# EAGLE design uwb (EAGLE 9.6.2)
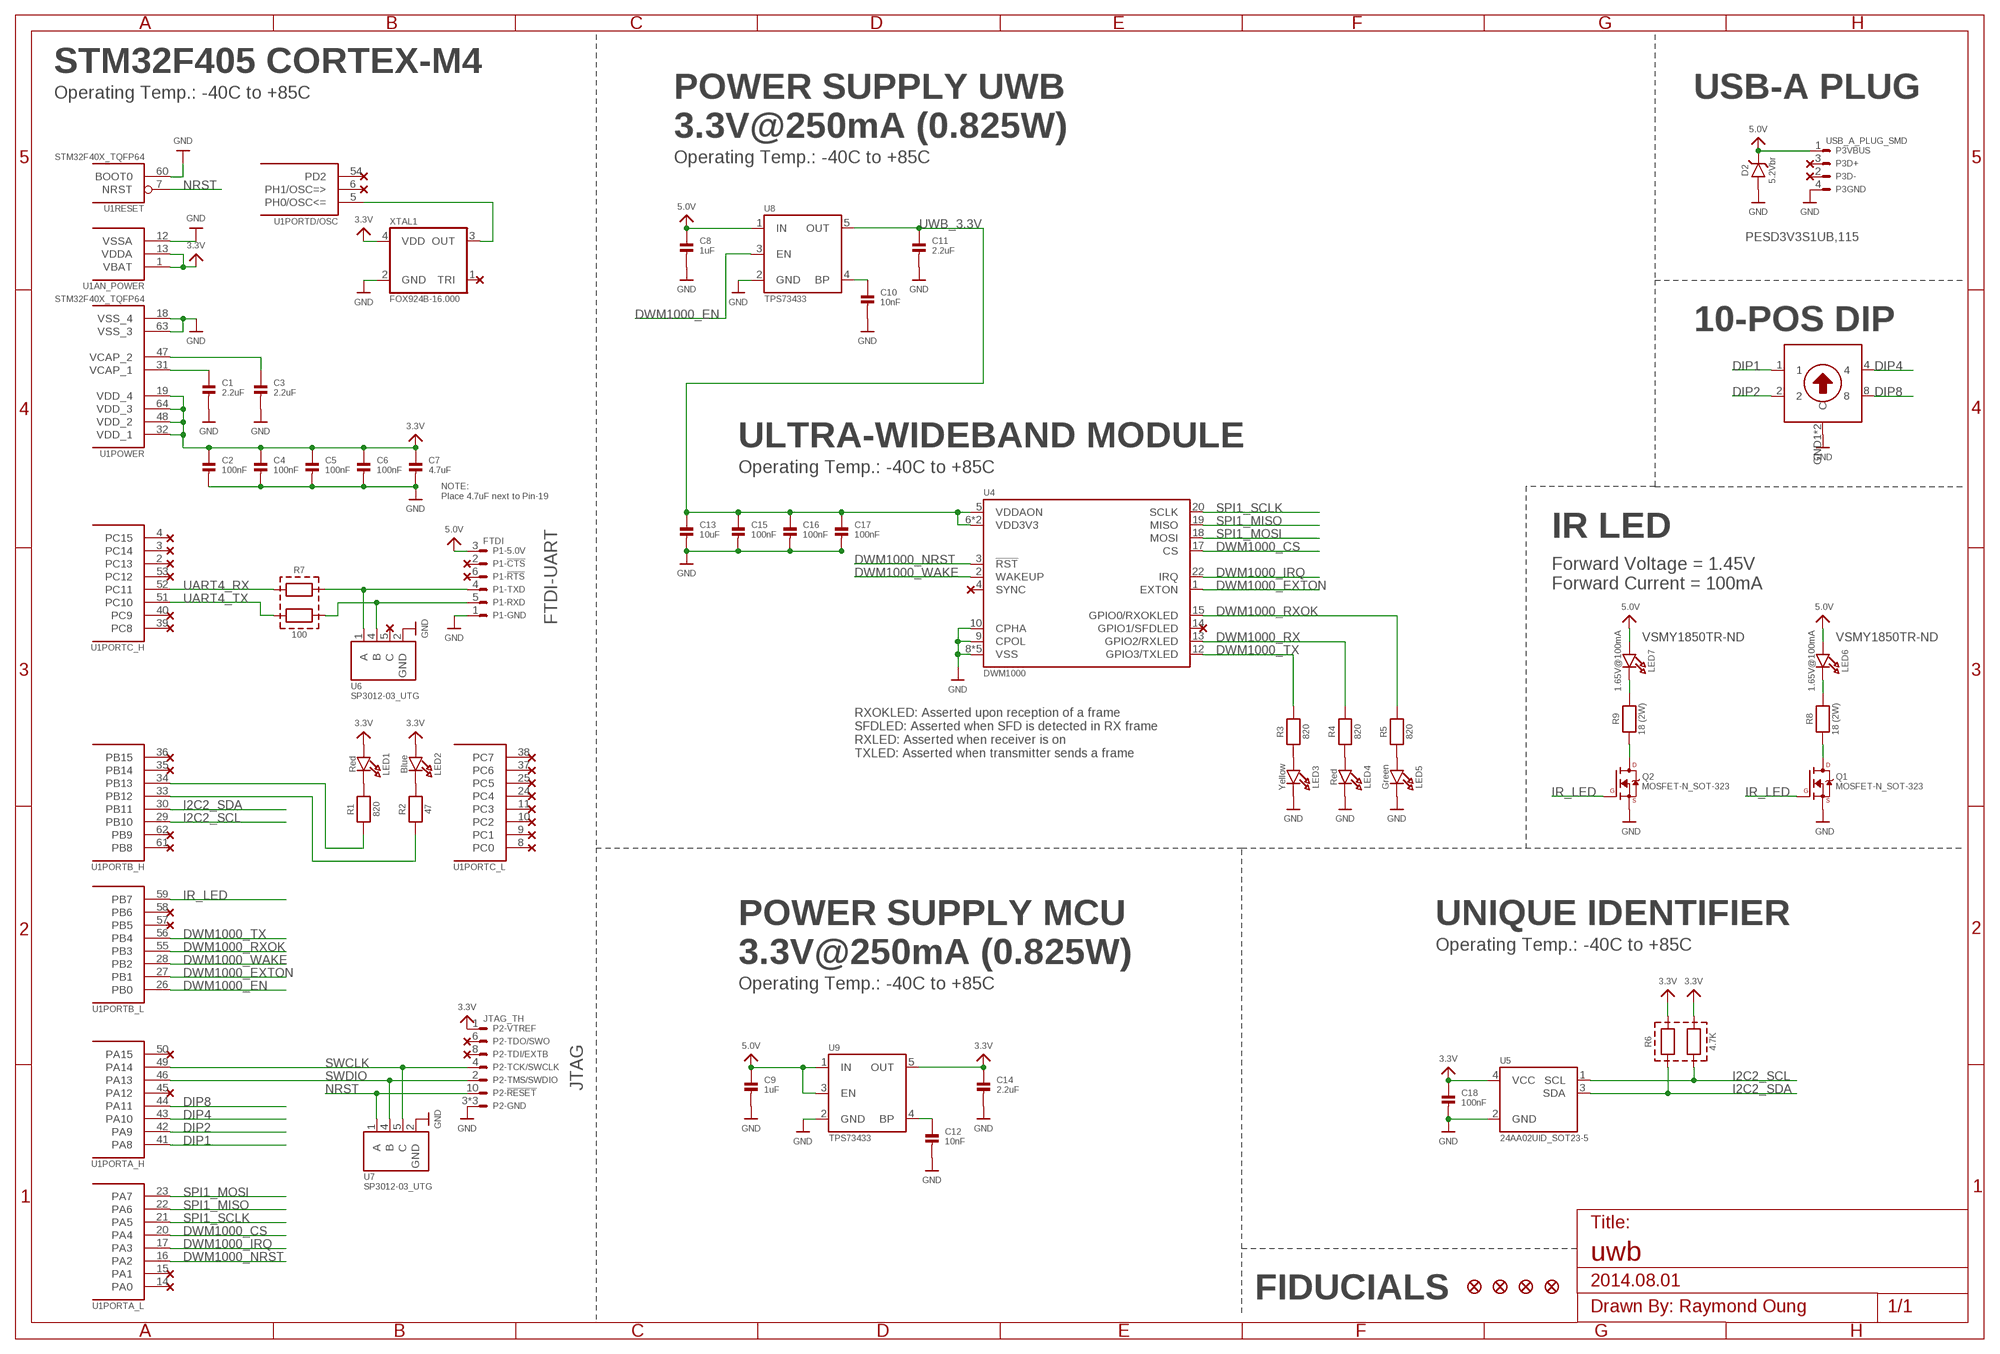
[diagram p0: schematic, sheet 1]

## Parts
C1  2.2uF  CAP_CERAMIC0402  [0402]
C2  100nF  CAP_CERAMIC0402  [0402]
C3  2.2uF  CAP_CERAMIC0402  [0402]
C4  100nF  CAP_CERAMIC0402  [0402]
C5  100nF  CAP_CERAMIC0402  [0402]
C6  100nF  CAP_CERAMIC0402  [0402]
C7  4.7uF  CAP_CERAMIC0402  [0402]
C8  1uF  CAP_CERAMIC0402  [0402]
C9  1uF  CAP_CERAMIC0402  [0402]
C10  10nF  CAP_CERAMIC0402  [0402]
C11  2.2uF  CAP_CERAMIC0402  [0402]
C12  10nF  CAP_CERAMIC0402  [0402]
C13  10uF  CAP_CERAMIC0603  [0603]
C14  2.2uF  CAP_CERAMIC0402  [0402]
C15  100nF  CAP_CERAMIC0402  [0402]
C16  100nF  CAP_CERAMIC0402  [0402]
C17  100nF  CAP_CERAMIC0402  [0402]
C18  100nF  CAP_CERAMIC0402  [0402]
D2  5.2Vbr  DIODE_ZENER_SOD523  [SOD-523]
LED1  Red  LED_0603  [CHIPLED_0603]
LED2  Blue  LED_0603  [CHIPLED_0603]
LED3  Yellow  LED_0603  [CHIPLED_0603]
LED4  Red  LED_0603  [CHIPLED_0603]
LED5  Green  LED_0603  [CHIPLED_0603]
LED6  1.65V@100mA  LED_0805  [CHIPLED_0805]
LED7  1.65V@100mA  LED_0805  [CHIPLED_0805]
P1  FTDI  [1X06_LOCK]
P2  JTAG_TH  [FTSH-105-01-XXX-DV]
P3  USB_A_PLUG_SMD  [USB-A_SMD]
P4  DIP10_SH-7000B  [SH-7000B]
Q1  MOSFET-N_SOT-323  [SOT323]
Q2  MOSFET-N_SOT-323  [SOT323]
R1  820  RESISTOR0402  [0402]
R2  47  RESISTOR0402  [0402]
R3  820  RESISTOR0402  [0402]
R4  820  RESISTOR0402  [0402]
R5  820  RESISTOR0402  [0402]
R6  4.7K  RESISTOR2_0603X2  [EXBV4V]
R7  100  RESISTOR2_0603X2  [EXBV4V]
R8  18 (2W)  RESISTOR2512  [2512]
R9  18 (2W)  RESISTOR2512  [2512]
REF1  FIDUCIAL1X2.5  [POINT-1MM]
REF2  FIDUCIAL1X2.5  [POINT-1MM]
REF3  FIDUCIAL1X2.5  [POINT-1MM]
REF4  FIDUCIAL1X2.5  [POINT-1MM]
U1  STM32F40X_TQFP64  [TQFP64]
U4  DWM1000  [DWM1000]
U5  24AA02UID_SOT23-5  [SOT23-5]
U6  SP3012-03_UTG  [UDFN06]
U7  SP3012-03_UTG  [UDFN06]
U8  TPS73433  [SOT23-5]
U9  TPS73433  [SOT23-5]
XTAL1  FOX924B-16.000  TCXO_5.0X3.2A  [OSCILLATOR-5.0X3.2A]

## Nets
3.3V [PWR]: C2.1 C4.1 C5.1 C6.1 C7.1 C14.1 C18.1 LED1.A LED2.A P2.1 R6.3 R6.4 U1.1(AN_POWER:VBAT) U1.13(AN_POWER:VDDA) U1.19(POWER:VDD_4) U1.32(POWER:VDD_1) U1.48(POWER:VDD_2) U1.64(POWER:VDD_3) U5.4(VCC) U9.5(OUT) XTAL1.4(VDD)
5.0V [PWR]: C8.1 C9.1 D2.K(C) LED6.A LED7.A P1.3 P3.1 U8.1(IN) U9.1(IN) U9.3(EN)
DIP1: P4.1 U1.41(PORTA_H:PA8)
DIP2: P4.2 U1.42(PORTA_H:PA9)
DIP4: P4.4 U1.43(PORTA_H:PA10)
DIP8: P4.8 U1.44(PORTA_H:PA11)
DWM1000_CS: U1.20(PORTA_L:PA4) U4.17(CS)
DWM1000_EN: U1.26(PORTB_L:PB0) U8.3(EN)
DWM1000_EXTON: U1.27(PORTB_L:PB1) U4.1(EXTON)
DWM1000_IRQ: U1.17(PORTA_L:PA3) U4.22(IRQ)
DWM1000_NRST: U1.16(PORTA_L:PA2) U4.3(!RST)
DWM1000_RX: R4.2 U4.13(GPIO2/RXLED)
DWM1000_RXOK: R5.2 U1.55(PORTB_L:PB3) U4.15(GPIO0/RXOKLED)
DWM1000_TX: R3.2 U1.56(PORTB_L:PB4) U4.12(GPIO3/TXLED)
DWM1000_WAKE: U1.28(PORTB_L:PB2) U4.2(WAKEUP)
GND: C1.2 C2.2 C3.2 C4.2 C5.2 C6.2 C7.2 C8.2 C9.2 C10.2 C11.2 C12.2 C13.2 C14.2 C15.2 C16.2 C17.2 C18.2 D2.A LED3.C LED4.C LED5.C P1.1 P2.3 P2.5 P2.9 P3.4 P4.GND1(C) P4.GND2(C) Q1.2(S) Q2.2(S) U1.12(AN_POWER:VSSA) U1.18(POWER:VSS_4) U1.60(RESET:BOOT0) U1.63(POWER:VSS_3) U4.8(VSS) U4.9(CPOL) U4.10(CPHA) U4.16(VSS) U4.21(VSS) U4.23(VSS) U4.24(VSS) U5.2(GND) U6.2(GND) U7.2(GND) U8.2(GND) U9.2(GND) XTAL1.2(GND)
I2C2_SCL: R6.2 U1.29(PORTB_H:PB10) U5.1(SCL)
I2C2_SDA: R6.1 U1.30(PORTB_H:PB11) U5.3(SDA)
IR_LED: Q1.1(G) Q2.1(G) U1.59(PORTB_L:PB7)
N$1: LED3.A R3.1
N$2: LED4.A R4.1
N$3: R2.1 U1.33(PORTB_H:PB12)
N$4: C10.1 U8.4(BP)
N$5: LED1.C R1.2
N$6: R1.1 U1.34(PORTB_H:PB13)
N$7: P1.5 R7.3 U6.4(B)
N$8: P1.4 R7.4 U6.1(A)
N$9 [PWR]: Q1.3(D) R8.1
N$10 [PWR]: LED6.C R8.2
N$11 [PWR]: Q2.3(D) R9.1
N$12 [PWR]: LED7.C R9.2
N$13: LED5.A R5.1
N$17: U1.5(PORTD/OSC:PH0/OSC<=) XTAL1.3(OUT)
N$19: LED2.C R2.2
N$42: C12.1 U9.4(BP)
NRST: P2.10 U1.7(RESET:NRST) U7.1(A)
SPI1_MISO: U1.22(PORTA_L:PA6) U4.19(MISO)
SPI1_MOSI: U1.23(PORTA_L:PA7) U4.18(MOSI)
SPI1_SCLK: U1.21(PORTA_L:PA5) U4.20(SCLK)
SWCLK: P2.4 U1.49(PORTA_H:PA14) U7.5(C)
SWDIO: P2.2 U1.46(PORTA_H:PA13) U7.4(B)
UART4_RX: R7.1 U1.52(PORTC_H:PC11)
UART4_TX: R7.2 U1.51(PORTC_H:PC10)
UWB_3.3V [PWR]: C11.1 C13.1 C15.1 C16.1 C17.1 U4.5(VDDAON) U4.6(VDD3V3) U4.7(VDD3V3) U8.5(OUT)
VCAP_1: C1.1 U1.31(POWER:VCAP_1)
VCAP_2: C3.1 U1.47(POWER:VCAP_2)
Unconnected: P1.2 P1.6 P2.6 P2.8 P3.2 P3.3 U1.2(PORTC_H:PC13) U1.3(PORTC_H:PC14) U1.4(PORTC_H:PC15) U1.6(PORTD/OSC:PH1/OSC=>) U1.8(PORTC_L:PC0) U1.9(PORTC_L:PC1) U1.10(PORTC_L:PC2) U1.11(PORTC_L:PC3) U1.14(PORTA_L:PA0) U1.15(PORTA_L:PA1) U1.24(PORTC_L:PC4) U1.25(PORTC_L:PC5) U1.35(PORTB_H:PB14) U1.36(PORTB_H:PB15) U1.37(PORTC_L:PC6) U1.38(PORTC_L:PC7) U1.39(PORTC_H:PC8) U1.40(PORTC_H:PC9) U1.45(PORTA_H:PA12) U1.50(PORTA_H:PA15) U1.53(PORTC_H:PC12) U1.54(PORTD/OSC:PD2) U1.57(PORTB_L:PB5) U1.58(PORTB_L:PB6) U1.61(PORTB_H:PB8) U1.62(PORTB_H:PB9) U4.4(SYNC) U4.14(GPIO1/SFDLED) U6.5(C) XTAL1.1(TRI)

## Notes on the sheet
- STM32F405 CORTEX-M4
- Operating Temp.: -40C to +85C | USB-A PLUG
- POWER SUPPLY UWB
  3.3V@250mA (0.825W)
- Operating Temp.: -40C to +85C
- PESD3V3S1UB,115
- 10-POS DIP
- ULTRA-WIDEBAND MODULE
- Operating Temp.: -40C to +85C
- NOTE:
  Place 4.7uF next to Pin-19
- IR LED
- FTDI-UART
- Forward Voltage = 1.45V
  Forward Current = 100mA
- VSMY1850TR-ND | VSMY1850TR-ND
- RXOKLED: Asserted upon reception of a frame
  SFDLED: Asserted when SFD is detected in RX frame
  RXLED: Asserted when receiver is on
  TXLED: Asserted when transmitter sends a frame
- UNIQUE IDENTIFIER
- Operating Temp.: -40C to +85C
- POWER SUPPLY MCU
  3.3V@250mA (0.825W)
- Operating Temp.: -40C to +85C
- JTAG
- 2014.08.01
- FIDUCIALS

## Library data of the parts
C1-C18 = custom-generic:CAP_CERAMIC: Ceramic Capacitor 0402 - 0402 Surface Mount Capacitors 16pF 50V 5% [Digikey: 445-4899-2-ND] 18pF 50V 5% [Digikey: 490-1281-2-ND] 22pF 50V 5% [Digikey: 490-1283-2-ND] 68pF 50V 5% [Digikey: 490-1289-2-ND] 0.1uF 10V 10% [Digikey: 490-1318-2-ND] 1.0uF 6.3V 10% [Digikey: 490-1320-2-ND] 0603 - 0603 Surface Mount Capacitors 16 pF 50V 5% [Digikey: 445-5051-2-ND] 22 pF 50V [Digikey: PCC220ACVTR-ND] 33 pF 50V 5% [Digikey: 490-1415-1-ND] 56pF 50V 5% [Digikey: 490-1421-1-ND] 220pF 50V 5% [Digikey: 445-1285-1-ND] 680 pF 50V 2200 pF 50V 5% C0G [Digikey: 445-1297-1-ND] 5600 pF 100V 5% X7R [Digikey: 478-3711-1-ND] 0.1 µF 25V 10% [Digikey: PCC2277TR-ND] 0.22 µF 16V 10% X7R [Digikey: 445-1318-1-ND] 1.0 µF 25V 10% [Digikey: 445-5146-2-ND] 0603 - RF Specific 3pF 250V +/-0.1pF RF [Digikey: 712-1347-1-ND] 18 pF 250V 5% [Digikey: 478-3505-1-ND or 712-1322-1-ND] 56 pF 250V 5% C0G RF [Digikey: 490-4867-1-ND] 68 pF 250V RF [Digikey: 490-4868-1-ND] 0805 - 0805 Surface Mount Capacitors 220 pF 250V 2% RF Ceramic Capacitor [Digikey: 712-1398-1-ND] 1000 pF 50V 2% NP0 Ceramic Capacitor [Digikey: 478-3760-1-ND] 0.1 µF 25V 10% Ceramic Capacitor [Digikey: PCC1828TR-ND] 1.0 µF 16V 10% Ceramic Capacitor[Digikey: 490-1691-2-ND] 10.0 µF 10V 10% Ceramic Capacitor[Digikey: 709-1228-1-ND] 10.0 uF 16V 10% Ceramic Capacitor [Digikey: 478-5165-2-ND] 47 uF 6.3V 20% Ceramic Capacitor [Digikey: 587-1779-1-ND or 399-5506-1-ND] 1206 - 1206 Surface Mount Capacitors 47uF 10V 20% Ceramic Capacitor [Digikey: 490-5528-1-ND or 399-5508-1-ND or 445-6010-1-ND]
D2 = custom-generic:DIODE_ZENER: Zener Diode / Transient Voltage Suppression Diode
LED1-LED7 = custom-generic:LED: LED 0603 - 0603 Surface Mount Package 2mA: Blue LED - Low Power (39.2mcd, 10 mA, 3.1Vf) - DigiKey: 475-1383-1-ND Green LED - Low Power (3.9mcd, 2mA, 1.7Vf) - Digikey: 475-2709-1-ND Orange LED - Low Power (9.8mcd, 2mA, 1.8Vf) - Digikey: 475-1194-2-ND Red LED - Low Power (5mcd, 2mA, 1.8Vf) - Digikey: 475-2506-1-ND Yellow LED - Low Power (7mcd, 2mA, 1.8Vf) - Digikey: 475-1196-1-ND 5mA: Blue LED - Low Power (17mcd, 5ma, 2.9Vf) - Digikey: LNJ937W8CRACT-ND 0805 - 0805 Surface Mount Package 2mA: Red LED (8.8mcd, 2mA, 1.8Vf, Clear) - Low Power [Digikey: 475-2510-1-ND] Green LED (5mcd, 2mA, 1.8Vf, Clear) - Low Power [Digikey: 475-2730-1-ND] Yellow LED (11.3mcd, 2mA, 1.8Vf, Clear) - Low Power [Digikey: 475-2555-1-ND] 20mA: Red LED (104mcd, 20mA, Diffused) - LS R976 [Digikey: 475-1278-6-ND] Red LED (12mcd, 20mA, 2.0Vf, Clear) - APT2012EC [Digikey: 754-1128-1-ND] Green LED (15mcd, 20mA, 2.2Vf, Clear) - APT2012GC [Digikey: 754-1131-1-ND] Orange LED (160mcd, 20mA, 2.1Vf, Clear) - APT2012SECK [Digikey: 754-1130-1-ND] 1206 - 1206 Surface Mount Package Green LED (26mcd, 20mA, Diffused) - LG N971 [Digikey: 475-1407-6-ND] Red LED (15mcd, 20mA, Diffused) - LH N974 [Digikey: 475-1416-6-ND]
P1 = custom-connectors:FTDI: USB TTL Serial Cable
P2 = custom-connectors:JTAG: JTAG Connector; DIGI-KEY: 952-1383-ND; MOUSER: 855-M50-3500542
P3 = custom-connectors:USB: USB-A Plug; DIGI-KEY: 1175-1021-ND
P4 = custom-mechanical:DIP10: 10-Position Rotary Switch with Shaft; DIGI-KEY: CT3096CT-ND
Q1 Q2 = custom-devices:MOSFET-N: N-Channel MOSFET; DIGI-KEY: 568-10309-1-ND; MOUSER: 771-BSS138PW115
R1-R5 R8 R9 = custom-generic:RESISTOR: Resistors 0402 - 0402 Surface Mount Package 22 Ohm 1% 1/16W [Digikey: 311-22.0LRTR-ND] 33 Ohm 5% 1/16W 1.0K 5% 1/16W 1.5K 5% 1/16W 2.0K 1% 1/16W 10.0K 1% 1/16W [Digikey: 311-10.0KLRTR-ND] 10.0K 5% 1/16W [Digikey: RMCF0402JT10K0TR-ND] 12.1K 1% 1/16W [Digikey: 311-22.0LRTR-ND] 100.0K 5% 1/16W 0603 - 0603 Surface Mount Package 0 Ohm 1/10 Watt 1% Resistor 15 Ohm 1/10 Watt 1% Resistor 33 Ohm 1/10 Watt 1% Resistor 49.9 Ohm 1/10 Watt 1% Resistor 100 Ohm 1/10 Watt 1% Resistor 150 Ohm 1/10 Watt 1% Resistor 240 Ohm 1/10 Watt 1% Resistor 390 Ohm 1/10 Watt 1% Resistor 560 Ohm 1/10 Watt 1% Resistor 680 Ohm 1/10 Watt 1% Resistor 750 Ohm 1/10 Watt 1% Resistor 1.0K Ohm 1/10 Watt 1% Resistor 1.5K Ohm 1/10 Watt 1% Resistor 2.0K Ohm 1/10 Watt 1% Resistor 2.2K Ohm 1/10 Watt 1% Resistor 3.3K Ohm 1/10 Watt 1% Resistor 4.7K Ohm 1/10 Watt 1% Resistor 10.0K Ohm 1/10 Watt 1% Resistor 12.0K Ohm 1/10 Watt 1% Resistor 12.1K Ohm 1/10 Watt 1% Resistor 20.0K Ohm 1/10 Watt 1% Resistor 33.0K Ohm 1/10 Watt 1% Resistor 100.0K Ohm 1/10 Watt 1% Resistor 0805 - 0805 Surface Mount Package 0 Ohm 1/8 Watt 1% Resistor 33 Ohm 1/8 Watt 1% Resistor 100 Ohm 1/8 Watt 1% Resistor 150 Ohm 1/8 Watt 1% Resistor 200 Ohm 1/8 Watt 1% Resistor 240 Ohm 1/8 Watt 1% Resistor 330 Ohm 1/8 Watt 1% Resistor 390 Ohm 1/8 Watt 1% Resistor 470 Ohm 1/8 Watt 1% Resistor 1.0K Ohm 1/8 Watt 1% Resistor 1.5K Ohm 1/8 Watt 1% Resistor 2.0K Ohm 1/8 Watt 1% Resistor 4.7K Ohm 1/8 Watt 1% Resistor 5.1K Ohm 1/8 Watt 1% Resistor 5.6K Ohm 1/8 Watt 1% Resistor 10.0K Ohm 1/8 Watt 1% Resistor 22.0K Ohm 1/8 Watt 1% Resistor 33.0K Ohm 1/8 Watt 1% Resistor 100K Ohm 1/8 Watt 1% Resistor 1206 - 1206 Surface Mount Package 2012 - 2010 Surface Mount Package 0.11 Ohm 1/2 Watt 1% Resistor - Digikey: RHM.11UCT-ND
R6 R7 = custom-generic:RESISTOR2: 2x Isolated Resistor Network
REF1-REF4 = custom-mechanical:FIDUCIAL: Fiducial Alignment Points Various fiducial points for machine vision alignment.
U1 = custom-devices:STM32F40X_TQFP64: STM32F40x 64-pin LQFP; DIGI-KEY: 497-11767-ND; MOUSER: 511-STM32F405RGT6
U4 = custom-devices:DWM1000: DecaWave Ultra-Wideband Module; DIGI-KEY: 1479-1002-1-ND
U5 = custom-devices:24AA02UID: 2K I2C Serial EEPROMs with Unique 32-bit Serial Number; DIGI-KEY: 24AA02UIDT-I/OTCT-ND
U6 U7 = custom-devices:SP3012-03: TVS Diode Arrays 3-Ch 12KV 0.5pF; DIGI-KEY: F6292CT-ND; MOUSER: 576-SP3012-03UTG
U8 U9 = custom-devices:TPS73433: 3.3V, 250mA, Low Quiescent Current, Ultra-Low Noise, High PSRR Low-Dropout Linear Regulator.; DIGI-KEY: 296-36844-1-ND; MOUSER: 595-TPS73433TDDCRQ1
XTAL1 = custom-generic:TCXO: Temperature Compensated Crystal Oscillator

## Net classes
0 default: width 0.152 mm, drill 0.305 mm, clearance 0.152 mm
1 PWR: width 0.203 mm, drill 0.305 mm, clearance 0.203 mm
2 GND: width 0.152 mm, drill 0.305 mm, clearance 0.203 mm

## Board
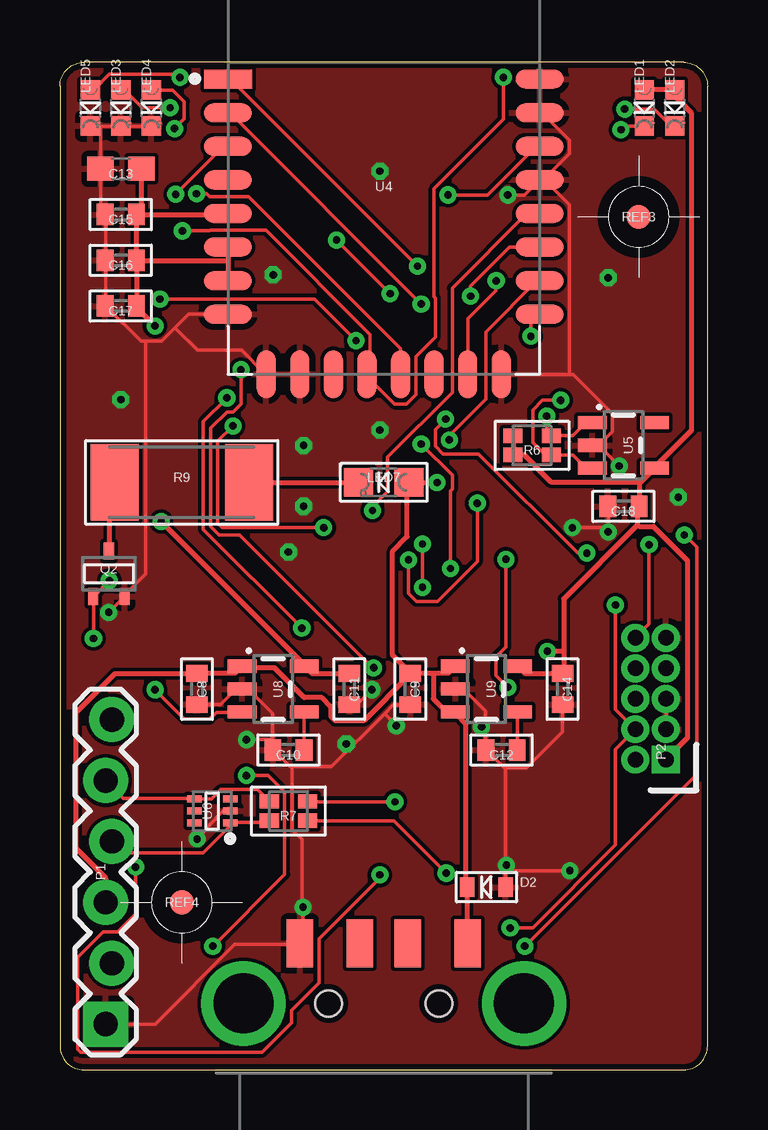
[diagram p1: board, top side]
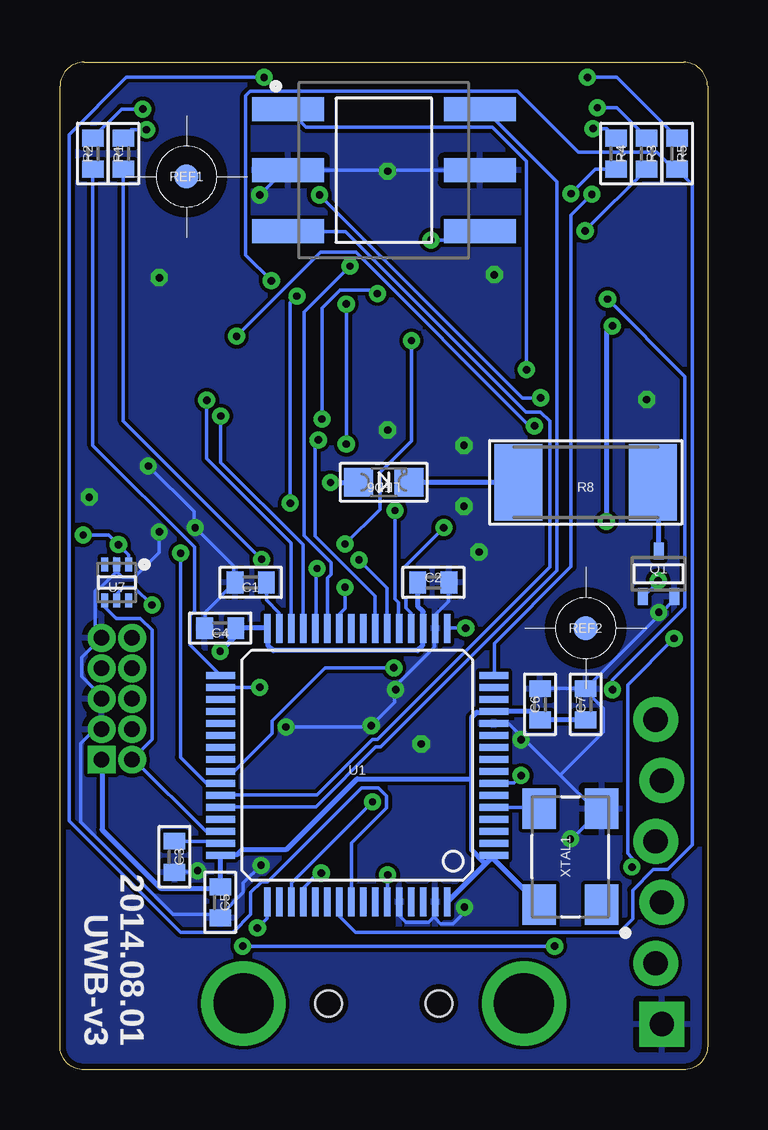
[diagram p2: board, bottom side, seen from below]

Size 27 x 42 mm. Coordinates in mm from the lower left corner, seen from the top.
Outline: 1,0 26,0 arc90 27,1 27,41 arc90 26,42 1,42 arc90 0,41 0,1 arc90 1,0
Copper layers (1*16): Top 0.035mm / dielectric 1.5mm / Bottom 0.035mm
Design rules "BetaLayout-2layer": minimum track width 6mil, minimum drill 8mil, track to track 6mil, track to pad 6mil, pad to pad 6mil, via to via 6mil, smd to smd 0mil, copper to edge 10mil, drill to drill 10mil, minimum pad ring 10mil, minimum via ring 8mil, stop-mask expansion 2mil, vias tented up to drill 100mil, thermal gap 10mil

### Footprints (pad centres in the part's own frame; a part is rotated, then mirrored left to right if it is on the bottom)
0402 = smd 0.7 x 0.9: 1 -0.65,0; 2 0.65,0
0603 = smd 1.1 x 1: 1 -0.85,0; 2 0.85,0
SOD-523 = smd 0.8 x 0.6: A 0,-0.8; K 0,0.8
CHIPLED_0603 = smd 0.8 x 0.8: A 0,-0.75; C 0,0.75
CHIPLED_0805 = smd 1.2 x 1.2: A 0,-1.05; C 0,1.05
1X06_LOCK = drill 1.016 pad 1.88 square: 1 0,0 | drill 1.016 pad 1.88: 2 2.54,-0.254; 3 5.08,0; 4 7.62,-0.254; 5 10.16,0; 6 12.7,-0.254
FTSH-105-01-XXX-DV = drill 0.65 pad 1 square: 1 0,0 | drill 0.65 pad 1: 2 0,1.27; 3 1.27,0; 4 1.27,1.27; 5 2.54,0; 6 2.54,1.27; 7 3.81,0; 8 3.81,1.27; 9 5.08,0; 10 5.08,1.27
USB-A_SMD = smd 1.1 x 2: 1 -3.5,-2.5; 2 -1,-2.5; 3 1,-2.5; 4 3.5,-2.5 | drill 2.5: NC1 -5.85,0; NC2 5.85,0 | hole 1.1: -2.3,0; 2.3,0
SH-7000B = smd 3 x 1: 1 -4,2.54; 2 4,-2.54; 4 -4,-2.54; 8 4,2.54; GND1 -4,0; GND2 4,0
SOT323 = smd 0.42 x 0.7: 1 -0.65,-0.95; 2 0.65,-0.95; 3 0,0.95
EXBV4V = smd 0.8 x 0.6: 1 -0.8,0.4; 2 -0.8,-0.4; 3 0.8,-0.4; 4 0.8,0.4
2512 = smd 2 x 3.2: 1 -2.8,0; 2 2.8,0
POINT-1MM = smd 1 x 1: 1 0,0
TQFP64 = smd 1.2 x 0.29: 1 -5.7,3.75; 2 -5.7,3.25; 3 -5.7,2.75; 4 -5.7,2.25; 5 -5.7,1.75; 6 -5.7,1.25; 7 -5.7,0.75; 8 -5.7,0.25; 9 -5.7,-0.25; 10 -5.7,-0.75; 11 -5.7,-1.25; 12 -5.7,-1.75; 13 -5.7,-2.25; 14 -5.7,-2.75; 15 -5.7,-3.25; 16 -5.7,-3.75; 33 5.7,-3.75; 34 5.7,-3.25; 35 5.7,-2.75; 36 5.7,-2.25; 37 5.7,-1.75; 38 5.7,-1.25; 39 5.7,-0.75; 40 5.7,-0.25; 41 5.7,0.25; 42 5.7,0.75; 43 5.7,1.25; 44 5.7,1.75; 45 5.7,2.25; 46 5.7,2.75; 47 5.7,3.25; 48 5.7,3.75 | smd 0.29 x 1.2: 17 -3.75,-5.7; 18 -3.25,-5.7; 19 -2.75,-5.7; 20 -2.25,-5.7; 21 -1.75,-5.7; 22 -1.25,-5.7; 23 -0.75,-5.7; 24 -0.25,-5.7; 25 0.25,-5.7; 26 0.75,-5.7; 27 1.25,-5.7; 28 1.75,-5.7; 29 2.25,-5.7; 30 2.75,-5.7; 31 3.25,-5.7; 32 3.75,-5.7; 49 3.75,5.7; 50 3.25,5.7; 51 2.75,5.7; 52 2.25,5.7; 53 1.75,5.7; 54 1.25,5.7; 55 0.75,5.7; 56 0.25,5.7; 57 -0.25,5.7; 58 -0.75,5.7; 59 -1.25,5.7; 60 -1.75,5.7; 61 -2.25,5.7; 62 -2.75,5.7; 63 -3.25,5.7; 64 -3.75,5.7
DWM1000 = smd 2 x 0.8: 1 -6.5,12.3; 2 -6.5,10.9; 3 -6.5,9.5; 4 -6.5,8.1; 5 -6.5,6.7; 6 -6.5,5.3; 7 -6.5,3.9; 8 -6.5,2.5; 17 6.5,2.5; 18 6.5,3.9; 19 6.5,5.3; 20 6.5,6.7; 21 6.5,8.1; 22 6.5,9.5; 23 6.5,10.9; 24 6.5,12.3 | smd 0.8 x 2: 9 -4.9,0; 10 -3.5,0; 11 -2.1,0; 12 -0.7,0; 13 0.7,0; 14 2.1,0; 15 3.5,0; 16 4.9,0
SOT23-5 = smd 0.55 x 1.2: 1 -0.95,-1.3; 2 0,-1.3; 3 0.95,-1.3; 4 0.95,1.3; 5 -0.95,1.3
UDFN06 = smd 0.3 x 0.6: 1 -0.5,-0.75; 2 0,-0.75; 3 0.5,-0.75; 4 0.5,0.75; 5 0,0.75; 6 -0.5,0.75
OSCILLATOR-5.0X3.2A = smd 1.7 x 1.4: 1 -2,-1.3; 2 2,-1.3; 3 2,1.3; 4 -2,1.3

### Placement (x,y rotation side)
C1  19.05,20.32 180 bottom
C2  11.43,20.32 0 bottom
C3  22.23,8.89 270 bottom
C4  20.32,18.41 180 bottom
C5  20.32,6.99 270 bottom
C6  6.99,15.24 90 bottom
C7  5.08,15.24 90 bottom
C8  5.71,15.88 270 top
C9  14.61,15.88 270 top
C10  9.53,13.34 180 top
C11  12.06,15.88 270 top
C12  18.41,13.34 180 top
C13  2.54,37.56 180 top
C14  20.95,15.88 270 top
C15  2.54,35.66 180 top
C16  2.54,33.75 180 top
C17  2.54,31.84 180 top
C18  23.5,23.5 180 top
D2  17.78,7.62 90 top
LED1  24.36,40.1 180 top
LED2  25.63,40.1 180 top
LED3  2.54,40.1 180 top
LED4  3.81,40.1 180 top
LED5  1.27,40.1 180 top
LED6  13.5,24.5 270 bottom
LED7  13.5,24.5 90 top
P1  1.91,1.91 90 top
P2  25.27,12.93 90 top
P3  13.5,2.77 180 top
P4  13.5,37.5 0 bottom
Q1  2.04,20.68 0 bottom
Q2  2.04,20.68 0 top
R1  24.36,38.2 90 bottom
R2  25.63,38.2 90 bottom
R3  2.54,38.2 270 bottom
R4  3.81,38.2 270 bottom
R5  1.27,38.2 270 bottom
R6  19.68,26.04 180 top
R7  9.53,10.79 180 top
R8  5.08,24.5 180 bottom
R9  5.08,24.5 0 top
REF1  21.73,37.24 0 bottom
REF2  5.08,18.41 0 bottom
REF3  24.13,35.56 0 top
REF4  5.08,6.99 0 top
U1  14.61,12.7 180 bottom
U4  13.5,29 0 top
U5  23.5,26.04 270 top
U6  6.35,10.79 90 top
U7  24.63,20.32 180 bottom
U8  8.89,15.88 270 top
U9  17.78,15.88 270 top
XTAL1  5.71,8.89 90 bottom

### Tracks (layer width: path | path; a pad name or v marks a point on that pad's centre or on a via)
3.3V  (via drill 0.3)
  Top 0.203: U9.5 19.1,16.82 19.38,16.54 20.95,16.54 C14.1 21.01,16.61 21.01,17.45 | LED1.A 24.38,40.87 25.63,40.87 LED2.A 25.68,40.77 25.68,40.54 26.34,39.88 26.34,26.67 24.84,25.17 U5.4 24.79,25.07 24.16,24.43 | R6.3 18.9,26.42 18.9,25.65 R6.4 19,25.63 19.36,25.63 20.5,24.49 24.08,24.49 24.16,24.43 | 24.16,24.43 24.16,23.5 C18.1 24.08,23.42 24.08,22.71 | 21.01,17.45 21.01,19.63 24.08,22.71 | v20.32,17.45 20.93,17.45 21.01,17.45 | P2.1 25.27,12.95 26.16,13.84 26.16,21.23 24.74,22.66 24.16,22.66 24.08,22.71
  Bottom 0.203: C7.1 5.08,14.61 6.99,14.61 C6.1 7.06,14.66 7.34,14.94 8.89,14.94 U1.13 8.99,14.91 9.63,14.91 9.83,14.71 9.83,12.14 | 9.26,8.6 U1.1 8.94,8.81 7.04,6.91 XTAL1.4 | 9.26,8.6 10.85,7.01 U1.64 | 9.83,12.14 9.83,9.17 9.32,8.66 9.26,8.6 | P2.1 25.25,12.93 25.25,10.01 22.81,7.57 20.4,7.57 C5.1 20.32,8.94 U1.48 20.22,8.99 19.58,8.99 19.38,9.2 17.55,9.2 14.61,12.14 9.91,12.14 9.83,12.14 | C2.1 12.06,20.32 12.06,19.3 11.86,19.1 11.86,18.41 U1.19 11.89,18.31 11.89,17.68 12.09,17.48 18.11,17.48 18.31,17.68 18.31,18.31 U1.32 18.36,18.41 C4.1 19.74,18.34 19.74,18.03 v20.32,17.45
5.0V  (via drill 0.3)
  Top 0.203: P3.1 16.99,5.28 16.99,7.62 D2.K 16.92,7.7 16.92,14.43 16.51,14.83 U9.3 16.46,14.94 16.1,14.94 15.57,15.47 15.57,16.46 15.57,16.54 | v15.72,24.49 14.55,24.49 LED7.A 14.48,24.41 14.48,22.23 13.87,21.61 13.87,17.3 14.55,16.61 C9.1 | 15.57,16.54 16.18,16.54 16.46,16.82 U9.1 | 15.57,16.54 14.61,16.54 C9.1 | C9.1 14.55,16.43 12.68,14.55 11.48,14.55 11.3,14.73 11.3,15.14 10.92,15.52 10.19,15.52 8.94,16.76 7.67,16.76 U8.1 7.57,16.82 7.29,16.54 5.71,16.54 C8.1 5.64,16.51 2.29,16.51 0.66,14.88 0.66,9.25 1.91,8 P1.3
  Bottom 0.203: v15.72,24.49 14.55,24.49 LED7.A
DIP1  (via drill 0.3)
  Top 0.152: v13.08,16.76 13.03,16.76 7.49,22.3 6.63,22.3 6.27,22.66 6.27,26.75 6.96,27.43 7.21,27.43 7.54,27.76 v7.54,29.18
  Bottom 0.152: v13.08,16.76 15.95,16.76 18.16,14.55 18.16,14.02 19.71,12.47 20.3,12.47 U1.41 | v7.54,29.18 7.54,37.87 8.97,39.29 16.74,39.29 17.48,40.03 P4.1
DIP2  (via drill 0.3)
  Top 0.152: v21.97,21.54 21.59,21.54 17.45,25.68 15.98,25.68 15.65,26.01 15.65,26.7 v16.08,27.13 | v11.53,34.59 v13.77,32.36
  Bottom 0.152: v21.97,21.54 21.97,13.03 20.9,11.96 20.32,11.96 U1.42 | v16.08,27.13 16.08,31.75 15.32,32.51 13.92,32.51 v13.77,32.36 | v11.53,34.59 9.88,34.59 9.53,34.95 P4.2
DIP4
  Bottom 0.152: U1.43 16.28,11.46 13.97,13.77 13.77,13.77 6.58,20.95 6.58,27.05 6.96,27.43 7.57,27.43 15.09,34.95 17.48,34.95 P4.4
DIP8
  Bottom 0.152: U1.44 20.3,10.97 16.33,10.97 13.84,13.46 13.64,13.46 6.27,20.83 6.27,37.03 9.27,40.03 P4.8
DWM1000_CS  (via drill 0.3)
  Top 0.152: v11,22.61 6.76,22.61 6.58,22.78 6.58,26.21 v7.21,26.85 | v19.63,30.58 19.63,31.14 U4.17
  Bottom 0.152: v11,22.61 12.72,20.88 12.72,19.76 12.57,19.61 12.57,19.25 12.37,19.05 12.37,18.41 U1.20 | v7.21,26.85 7.42,26.85 14.66,34.09 16.13,34.09 v19.63,30.58
DWM1000_EN  (via drill 0.3)
  Top 0.152: v3.96,15.85 5.18,14.63 6.25,14.63 6.53,14.91 7.57,14.91 U8.3 | v4.17,32.13 10.62,32.13 v12.34,30.4 | v15.11,20.12 v15.11,21.92
  Bottom 0.152: v3.96,15.85 3.96,16.26 0.94,19.28 0.94,28.91 v4.17,32.13 | v12.34,30.4 12.34,26.21 13.66,24.89 13.66,23.37 v15.11,21.92 | v15.11,20.12 15.11,19.23 15.34,19 15.34,18.41 U1.26
DWM1000_EXTON  (via drill 0.3)
  Top 0.152: v14.91,33.5 7.14,41.27 7.01,41.27 U4.1
  Bottom 0.152: v14.91,33.5 16.82,31.6 16.82,22.28 15.7,21.16 15.7,20.65 15.85,20.5 15.85,18.41 U1.27
DWM1000_IRQ  (via drill 0.3)
  Top 0.152: v10.08,18.41 5.97,22.53 5.97,27.03 v6.96,28.02 | v16.18,36.47 17.83,36.47 19.84,38.48 19.99,38.48 U4.22
  Bottom 0.152: v10.08,18.41 10.85,18.41 U1.17 | v6.96,28.02 7.72,28.02 v16.18,36.47
DWM1000_NRST  (via drill 0.3)
  Top 0.152: v4.83,36.5 6.81,38.48 6.99,38.48 U4.3
  Bottom 0.152: v4.83,36.5 5.69,35.64 5.69,20.98 8.89,17.78 8.89,16.46 U1.16
DWM1000_RX  (via drill 0.3)
  Top 0.152: v5.69,36.52 6.12,36.52 6.25,36.4 7.87,36.4 14.2,30.07 U4.13
  Bottom 0.152: v5.69,36.52 4.67,37.54 R4.2
DWM1000_RXOK  (via drill 0.3)
  Top 0.152: v18.19,32.89 18.19,32.49 17.02,31.32 17.02,29.01 U4.15
  Bottom 0.152: v18.19,32.89 19.25,33.96 19.25,40.62 19.07,40.79 7.92,40.79 5.38,38.25 2.11,38.25 1.42,37.57 1.27,37.57 R5.2 1.22,37.49 0.64,36.91 0.64,9.37 1.65,8.36 2.26,8.36 3.12,7.49 3.12,6.3 3.68,5.74 14.68,5.74 15.34,6.4 15.34,6.99 U1.55
DWM1000_TX  (via drill 0.3)
  Top 0.152: v18.49,41.38 18.49,39.62 15.6,36.73 15.6,32.23 15.65,32.18 15.65,30.56 14.83,29.74 14.83,28.14 14.45,27.76 13.95,27.76 12.78,28.93 U4.12 12.85,29.06 12.93,29.13 12.93,30.66 8.59,35 6.27,35 6.25,34.98 v5.11,34.98
  Bottom 0.152: v18.49,41.38 24.23,41.38 26.62,38.99 26.62,10.39 21.97,5.74 19.79,5.74 19.05,6.48 19.05,7.39 18.59,7.85 18.34,7.85 14.43,11.76 13.72,11.76 13.39,11.43 13.39,10.92 14.83,9.47 14.83,7.01 U1.56 | v5.11,34.98 R3.2
DWM1000_WAKE  (via drill 0.3)
  Top 0.152: v16.28,20.9 16.28,24.13 16.36,24.21 16.36,24.79 v15.06,26.09 | v15.06,31.93 7.11,39.88 7.01,39.88 U4.2
  Bottom 0.152: v16.28,20.9 16.33,20.85 16.33,18.41 U1.28 | v15.06,31.93 v15.06,26.09
GND  (via drill 0.3)
  Top 0.152: U4.24 20.02,41.27 20.02,39.9 U4.23 20.09,39.9 21.23,38.76 21.23,38.2 20.17,37.13 U4.21 | v18.67,36.47 19.36,36.47 19.94,37.06 U4.21 | P2.3 25.27,14.22 P2.5 | 18.57,12.55 18.57,8.53 | 18.57,8.53 18.57,7.62 D2.A | 18.57,12.55 C12.2 17.73,13.39 17.73,14.3 | 18.57,8.53 v18.62,8.53 18.62,8.31 v21.26,8.31 | C14.2 20.95,14.1 19.46,12.6 18.62,12.6 18.57,12.55 | 17.73,14.3 17.73,14.96 16.82,15.88 U9.2 | U4.10 9.98,29.01 8.61,29.01 U4.9 8.53,29.03 7.57,30 5.74,30 4.85,30.89 4.8,30.94 | 1.7,39.34 LED3.C 2.59,39.34 LED4.C | 1.7,39.34 LED5.C | 1.7,39.34 1.7,39.29 1.7,37.57 C13.2 1.7,37.49 1.7,35.87 1.85,35.71 C15.2 1.91,35.64 1.91,33.81 C16.2 1.91,33.73 1.91,31.85 C17.2 1.96,31.8 3.38,30.38 3.58,30.38 | 4.8,30.94 4.24,30.38 3.58,30.38 | 4.8,30.94 5.36,31.5 6.99,31.5 U4.8 | v2.03,19.07 2.67,19.71 Q2.2 2.72,19.81 3.58,20.68 3.58,30.33 3.58,30.38 | v5.71,9.63 6.15,10.06 6.15,10.13 6.81,10.79 7.09,10.79 U6.2 | v13.01,15.85 12.39,15.24 12.06,15.24 C11.2 | C8.2 5.71,15.24 6.71,15.24 7.34,15.88 7.57,15.88 U8.2 7.64,15.82 7.9,15.82 8.87,14.86 8.87,13.34 C10.2 | 13.53,14.85 11.33,12.65 9.68,12.65 | 13.53,14.85 13.89,15.21 C9.2 | 9.68,12.65 9.6,12.65 8.94,13.31 C10.2 | 9.68,12.65 9.68,12.6 9.68,10.01 10.08,9.6 10.08,6.83 v10.13,6.78 10.13,5.41 10.01,5.28 P3.4 9.93,5.23 7.29,5.23 3.96,1.91 P1.1 | v14.02,14.35 13.56,14.81 13.53,14.85 | v7.77,13.77 8.81,13.77 C10.2 | v17.58,14.3 17.68,14.3 17.73,14.3 | C18.2 v22.86,22.43 22.81,22.61 v21.36,22.61 | 21.23,28.98 18.41,28.98 U4.16 | 21.23,28.98 21.41,28.98 23.04,27.36 23.04,26.62 22.45,26.04 U5.2 22.5,25.98 v23.32,25.17 | 21.23,28.98 21.23,29.03 21.23,36.07 20.22,37.08 U4.21
  Bottom 0.152: P4.GND2 9.53,37.52 17.48,37.52 P4.GND1 17.58,37.49 17.65,37.49 v18.67,36.47 | P2.5 25.27,15.49 25.27,15.6 26.09,16.41 26.09,17.2 25.32,17.96 P2.9 25.32,18.06 25.53,18.26 25.53,19.96 25.38,20.12 25.3,20.12 24.64,20.78 | v18.62,8.53 19.36,7.8 19.36,7.39 20.32,6.43 20.32,6.35 C5.2 20.37,6.48 22.28,6.48 26.14,10.34 26.14,13.61 25.55,14.2 P2.3 | v21.26,8.31 21.31,8.26 22.23,8.26 C3.2 | 1.96,19.02 C7.2 | 1.96,19.02 1.4,19.58 1.4,19.71 Q1.2 | v2.03,19.07 2.01,19.07 1.96,19.02 | C6.2 5.13,15.9 C7.2 | v5.71,9.63 5.66,9.63 4.42,10.87 XTAL1.2 4.62,10.77 6.15,12.29 | 6.15,12.29 7.7,13.84 | 7.7,13.84 8.28,14.43 8.89,14.43 U1.12 | C7.2 5.05,15.82 5.05,15.77 4.34,15.06 4.34,14.1 6.1,12.34 6.15,12.29 | C2.2 10.79,20.32 10.79,19.53 11.33,19 11.33,18.47 U1.18 11.38,18.39 11.38,17.63 13.01,16 v13.01,15.85 13.06,15.8 13.06,15.32 v14.02,14.35 14.07,14.3 v17.58,14.3 | 11.4,6.38 11.63,6.15 12.57,6.15 12.85,6.43 12.85,6.99 U1.60 | 11.4,6.38 11.38,6.4 11.38,6.99 U1.63 | v10.13,6.78 10.13,6.58 10.62,6.1 11.12,6.1 11.35,6.33 11.4,6.38 | v7.77,13.77 7.75,13.79 7.7,13.84 | C4.2 20.95,18.41 20.95,19.07 C1.2 19.76,20.37 19.76,21.01 v21.36,22.61 21.41,22.66 21.41,23.27 v23.32,25.17 | 24.64,20.78 24.64,21.06 U7.2 | v22.86,22.43 22.86,21.57 23.9,20.52 24.38,20.52 24.59,20.73 24.64,20.78
  other vias: 2.54,27.94 10.16,26.04 22.86,33.02 9.53,21.59 10.16,23.5 13.34,26.67 25.78,23.88 13.34,37.47 11.94,13.59 8.89,33.15
  pour Top: 0,0 27,0 27,42 0,42
  pour Bottom: 0,0 27,0 27,42 0,42
I2C2_SCL  (via drill 0.3)
  Top 0.152: U5.1 22.17,26.98 21.92,26.98 21.39,26.44 20.5,26.44 R6.2 20.45,26.49 20.3,26.64 v20.3,27.25
  Bottom 0.152: v20.3,27.25 20.3,25.32 16.87,21.89 16.87,18.41 U1.29
I2C2_SDA  (via drill 0.3)
  Top 0.152: U5.3 22.17,25.09 21.92,25.09 21.39,25.63 20.5,25.63 R6.1 20.42,25.65 20.22,25.65 19.71,26.16 19.71,27.51 20.12,27.91 v20.88,27.91
  Bottom 0.152: v20.88,27.91 20.88,25.48 17.37,21.97 17.37,18.41 U1.30
IR_LED  (via drill 0.3)
  Top 0.152: v2.06,20.4 Q2.1 1.4,19.66 v1.4,17.98 | v13.34,8.13 13.34,8 10.79,5.46 10.79,3.63 9.65,2.49 9.65,1.96 8.43,0.74 0.86,0.74 0.74,0.86 0.74,4.7 1.8,5.77 2.41,5.77 3.15,6.5 v3.15,8.46
  Bottom 0.152: v2.06,20.4 2.06,20.34 2.67,19.74 Q1.1 | v13.34,8.13 13.34,7.01 U1.59 | v3.15,8.46 3.15,8.84 3.33,9.02 3.33,16.05 v1.4,17.98
N$1  (via drill 0.3)
  Top 0.152: v4.6,40.11 3.43,40.11 2.69,40.84 LED3.A
  Bottom 0.152: v4.6,40.11 3.79,40.11 2.54,38.86 R3.1
N$2  (via drill 0.3)
  Top 0.152: v4.78,39.24 5.18,39.65 5.18,40.36 4.7,40.84 LED4.A
  Bottom 0.152: v4.78,39.24 4.19,39.24 3.81,38.86 R4.1
N$3
  Bottom 0.152: R2.1 25.63,26.04 21.39,21.79 21.39,19.13 21.57,18.95 21.57,17.7 20.32,16.46 U1.33
N$4
  Top 0.152: C10.1 10.19,14.91 U8.4
N$5  (via drill 0.3)
  Top 0.152: v23.39,39.19 23.55,39.34 LED1.C
  Bottom 0.152: v23.39,39.19 24.03,39.19 24.36,38.86 R1.2
N$6  (via drill 0.3)
  Top 0.152: v18.59,21.29 18.59,17.63 18.19,17.22 18.19,16.43 v18.67,15.95
  Bottom 0.152: v18.59,21.29 24.36,27.05 R1.1 | v18.67,15.95 U1.34
N$7
  Top 0.152: R7.3 8.23,11.68 6.71,11.68 6.33,11.3 5.61,11.3 U6.4 5.54,11.33 2.64,11.33 P1.5
N$8
  Top 0.152: R7.4 8.64,10.31 7.11,10.31 U6.1 7.06,10.24 7.06,10.13 5.97,9.04 2.64,9.04 P1.4
N$9
  Bottom 0.203: Q1.3 2.06,21.64 2.06,24.28 2.26,24.49 R8.1
N$10
  Bottom 0.203: LED6.C 12.45,24.49 7.9,24.49 R8.2
N$11
  Top 0.203: Q2.3 2.06,21.64 2.06,24.28 2.26,24.49 R9.1
N$12
  Top 0.203: LED7.C 12.45,24.49 7.9,24.49 R9.2
N$13  (via drill 0.3)
  Top 0.152: v5,41.38 4.88,41.5 2.06,41.5 1.42,40.87 1.27,40.87 LED5.A
  Bottom 0.152: v5,41.38 3.79,41.38 1.27,38.86 R5.1
N$17
  Bottom 0.152: U1.5 8.89,10.95 7.09,10.95 7.04,10.9 XTAL1.3
N$19  (via drill 0.3)
  Top 0.152: v23.55,40.06 24.79,40.06 25.48,39.37 25.63,39.37 LED2.C
  Bottom 0.152: v23.55,40.06 24.43,40.06 25.63,38.86 R2.2
N$42
  Top 0.152: C12.1 19.07,13.34 19.07,14.91 U9.4
NRST  (via drill 0.3)
  Top 0.152: v24.56,21.89 24.56,18.59 24,18.03 P2.10 | v7.77,12.27 8.69,12.27 9.37,11.58 9.37,8.15 v6.38,5.16 | v19.38,5.16 26.54,12.32 26.54,21.79 v26.04,22.3
  Bottom 0.152: U7.1 24.13,21.08 24.13,21.46 v24.56,21.89 24.61,21.95 24.97,22.3 v26.04,22.3 | v7.77,12.27 8.08,11.96 8.89,11.96 U1.7 | v19.38,5.16 v6.38,5.16
SPI1_MISO  (via drill 0.3)
  Top 0.152: v14.53,21.26 14.53,19.86 14.86,19.53 15.75,19.53 17.4,21.18 v17.4,23.62 | v17.12,32.26 17.12,32.66 18.75,34.29 U4.19
  Bottom 0.152: v14.53,21.26 13.36,20.09 13.36,18.41 U1.22 | v17.4,23.62 17.4,31.98 v17.12,32.26
SPI1_MOSI  (via drill 0.3)
  Top 0.152: v16.23,26.26 16.23,26.44 17.75,27.96 17.75,30.76 19.89,32.89 U4.18
  Bottom 0.152: v16.23,26.26 16.36,26.14 16.36,22.25 13.87,19.76 13.87,18.41 U1.23
SPI1_SCLK  (via drill 0.3)
  Top 0.152: v13.03,23.32 13.03,23.47 13.66,24.11 13.66,25.55 16.36,28.25 16.36,32.59 19.46,35.69 19.99,35.69 U4.20
  Bottom 0.152: v13.03,23.32 13.03,19.63 12.88,19.48 12.88,18.41 U1.21
SWCLK  (via drill 0.3)
  Top 0.152: v23.16,19.38 23.16,15.04 23.98,14.22 P2.4 23.95,14.15 23.16,13.36 23.16,9.37 19.71,5.92 v18.77,5.92
  Bottom 0.152: v23.16,19.38 23.9,20.12 24.36,20.12 24.61,19.86 24.61,19.58 U7.5 | v18.77,5.92 18.36,6.33 18.36,6.99 U1.49
SWDIO
  Bottom 0.152: U7.4 25.12,19.56 25.12,19.28 24.66,18.82 23.65,18.82 23.16,18.34 23.16,13.77 23.98,12.95 P2.2 23.9,12.93 20.93,9.96 20.32,9.96 U1.46
UART4_RX  (via drill 0.3)
  Top 0.152: v16.1,8.2 13.92,10.39 R7.1
  Bottom 0.152: v16.1,8.2 16.23,8.2 16.84,7.59 16.84,7.01 U1.52
UART4_TX  (via drill 0.3)
  Top 0.152: v13.97,11.18 10.34,11.18 R7.2
  Bottom 0.152: v13.97,11.18 17.35,7.8 17.35,7.01 U1.51
UWB_3.3V  (via drill 0.3)
  Top 0.203: 7.01,33.73 U4.6 | 7.01,33.73 7.01,32.92 U4.7 | C11.1 12.06,16.54 10.49,16.54 10.21,16.82 U8.5 10.16,16.92 v4.22,22.86 | C16.1 3.2,33.73 3.2,31.85 C17.1 3.23,31.75 v3.96,31.01 | C15.1 3.2,35.64 3.2,33.83 C16.1 | 7.01,33.73 6.93,33.73 3.3,33.73 C16.1 | C15.1 6.96,35.66 U4.5 | C13.1 3.39,35.85 C15.1
  Bottom 0.203: v4.22,22.86 4.22,30.76 v3.96,31.01
VCAP_1
  Bottom 0.152: C1.1 18.39,19.58 17.86,19.05 17.86,18.41 U1.31
VCAP_2
  Bottom 0.152: C3.1 22.23,9.53 20.37,9.53 20.32,9.47 U1.47

### Text on the board
bPlace: 2014.08.01 | UWB-v3